# EAGLE design iBookG3Clamshell_T4p0 (EAGLE 9.6.2)
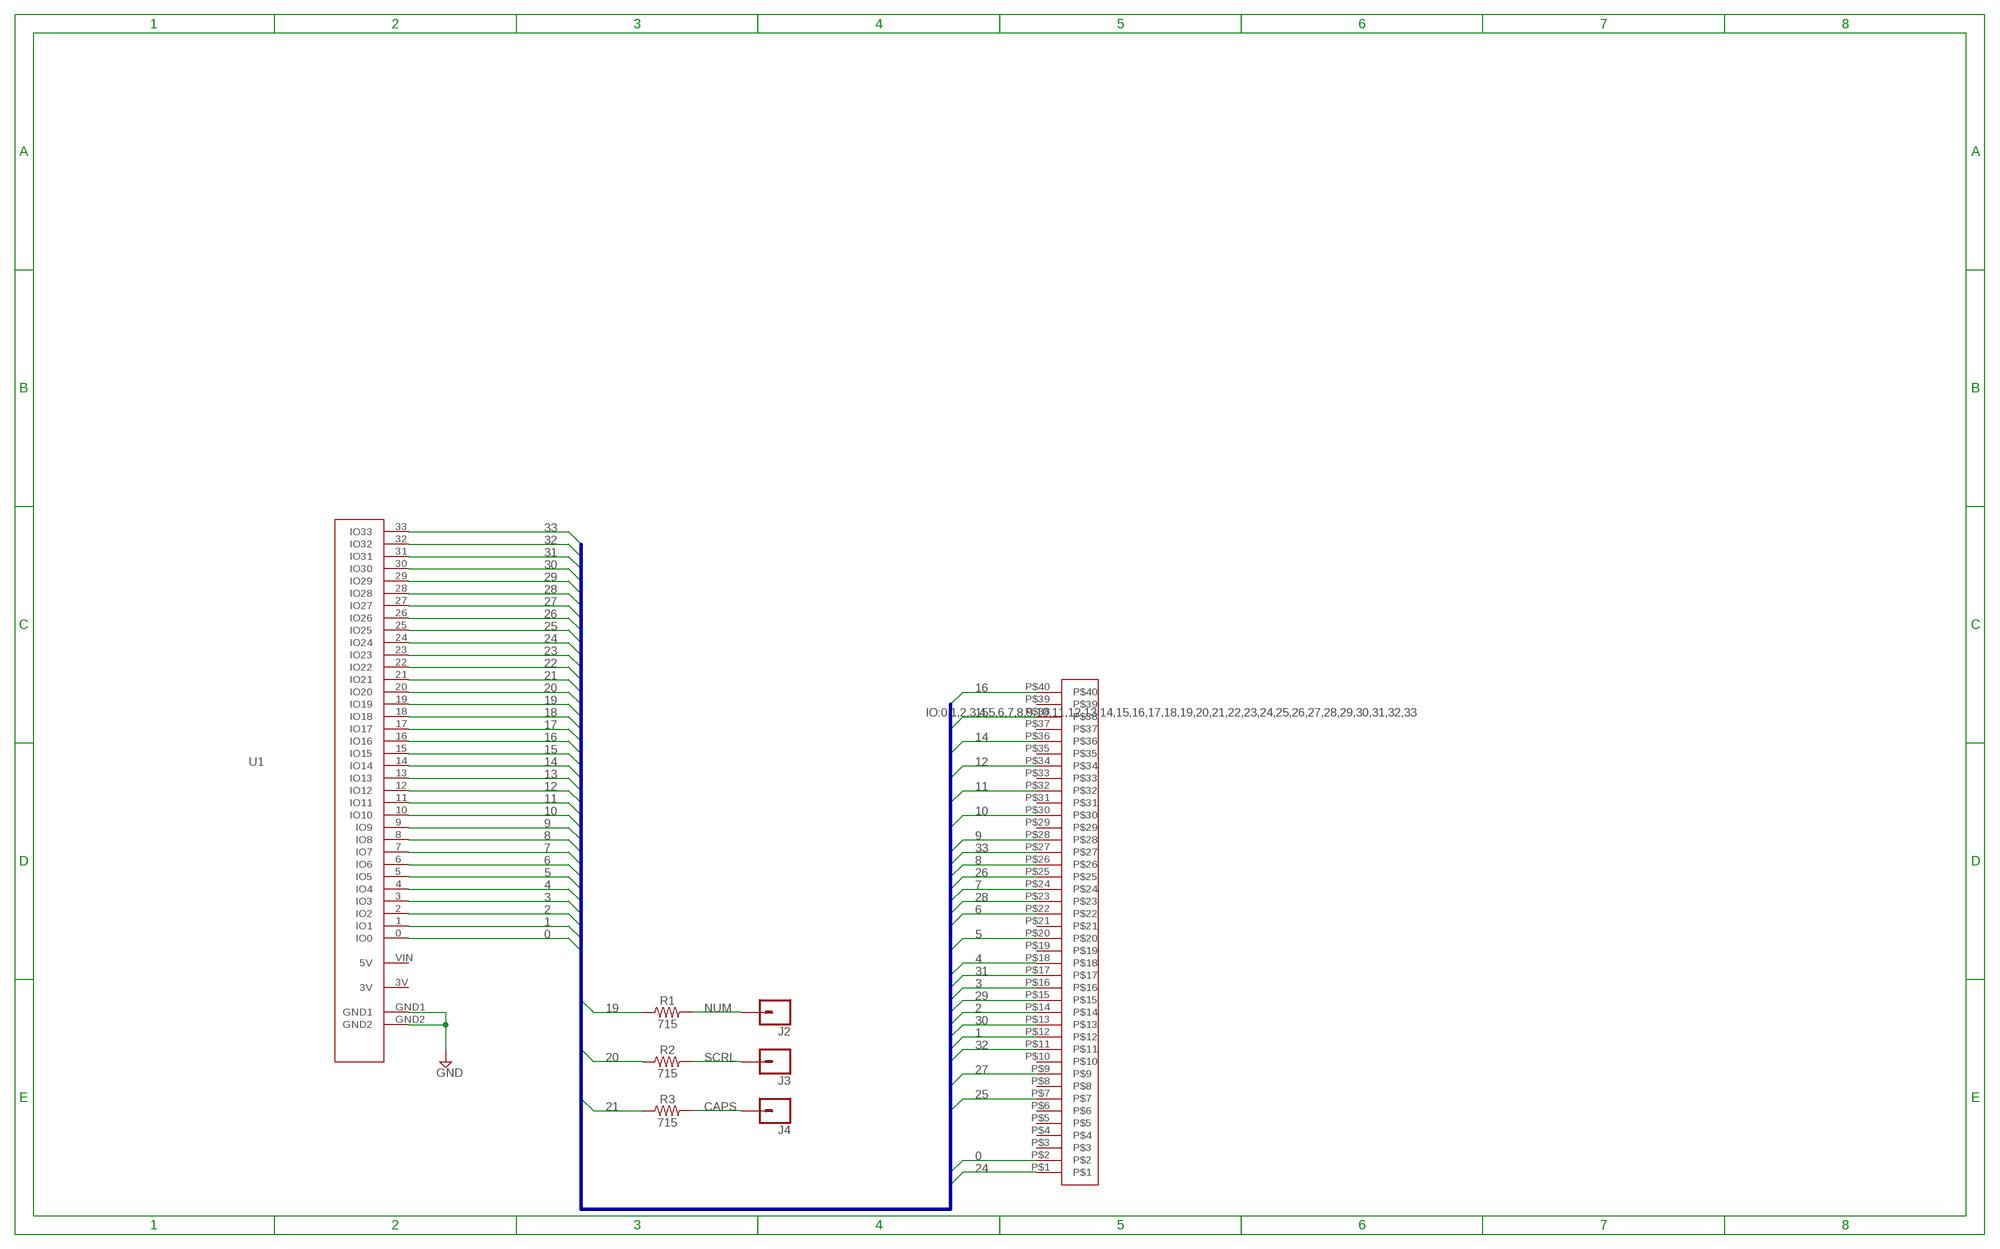
[diagram p0: schematic, sheet 1]

## Parts
J1  HDR127MET40FGVSMDR  [HDR127MET40FGVSMDR]
J2  CONN_01PTH_NO_SILK_YES_STOP  [1X01_NO_SILK]
J3  CONN_01PTH_NO_SILK_YES_STOP  [1X01_NO_SILK]
J4  CONN_01PTH_NO_SILK_YES_STOP  [1X01_NO_SILK]
R1  715  715OHM-0603-1/10W-1%  [0603]
R2  715  715OHM-0603-1/10W-1%  [0603]
R3  715  715OHM-0603-1/10W-1%  [0603]
U1  TEENSY4P0_CUTOUT  [TEENSY4P0_CUTOUT]

## Nets
0: J1.P$2 U1.0(IO0)
1: J1.P$12 U1.1(IO1)
2: J1.P$14 U1.2(IO2)
3: J1.P$16 U1.3(IO3)
4: J1.P$18 U1.4(IO4)
5: J1.P$20 U1.5(IO5)
6: J1.P$22 U1.6(IO6)
7: J1.P$24 U1.7(IO7)
8: J1.P$26 U1.8(IO8)
9: J1.P$28 U1.9(IO9)
10: J1.P$30 U1.10(IO10)
11: J1.P$32 U1.11(IO11)
12: J1.P$34 U1.12(IO12)
13: U1.13(IO13)
14: J1.P$36 U1.14(IO14)
15: J1.P$38 U1.15(IO15)
16: J1.P$40 U1.16(IO16)
17: U1.17(IO17)
18: U1.18(IO18)
19: R1.1 U1.19(IO19)
20: R2.1 U1.20(IO20)
21: R3.1 U1.21(IO21)
22: U1.22(IO22)
23: U1.23(IO23)
24: J1.P$1 U1.24(IO24)
25: J1.P$7 U1.25(IO25)
26: J1.P$25 U1.26(IO26)
27: J1.P$9 U1.27(IO27)
28: J1.P$23 U1.28(IO28)
29: J1.P$15 U1.29(IO29)
30: J1.P$13 U1.30(IO30)
31: J1.P$17 U1.31(IO31)
32: J1.P$11 U1.32(IO32)
33: J1.P$27 U1.33(IO33)
CAPS: J4.1 R3.2
GND: U1.GND1 U1.GND2
NUM: J2.1 R1.2
SCRL: J3.1 R2.2
Unconnected: J1.P$3 J1.P$4 J1.P$5 J1.P$6 J1.P$8 J1.P$10 J1.P$19 J1.P$21 J1.P$29 J1.P$31 J1.P$33 J1.P$35 J1.P$37 J1.P$39 U1.3V U1.VIN(5V)

## Buses
IO:0,1,2,3,4,5,6,7,8,9,10,11,12,13,14,15,16,17,18,19,20,21,22,23,24,25,26,27,28,29,30,31,32,33

## Library data of the parts
J1 = HDR127MET40FGVSMDR:HDR127MET40FGVSMDR
J2-J4 = SparkFun-Connectors:CONN_01: Single connection point. Often used as Generic Header-pin footprint for 0.1 inch spaced/style header connections On any of the 0.1 inch spaced packages, you can populate with these: Break Away Headers - Straight <https://www.sparkfun.com/products/116> (PRT-00116) Break Away Male Headers - Right Angle <https://www.sparkfun.com/products/553> (PRT-00553) Female Headers <https://www.sparkfun.com/products/115> (PRT-00115) Break Away Headers - Machine Pin <https://www.sparkfun.com/products/117> (PRT-00117) Break Away Female Headers - Swiss Machine Pin <https://www.sparkfun.com/products/743> (PRT-00743) This device is also useful as a general connection point to wire up your design to another part of your project. Our various solder wires solder well into these plated through hole pads. Hook-Up Wire - Assortment (Stranded, 22 AWG) <https://www.sparkfun.com/products/11375> (PRT-11375) Hook-Up Wire - Assortment (Solid Core, 22 AWG) <https://www.sparkfun.com/products/11367> (PRT-11367) View the entire wire category on our website here <https://www.sparkfun.com/categories/141> Special notes: SMTSO-256-ET is a "flush mount" nut for a 4-40 screw. We mostly use this on specialty testbeds; it is a nice way to connect hardware to your PCB at an adjustable hieght. Also note, the SNAP packages are for using a snappable style connector. We sell a baggie of snaps and they are also used on two LilyPad designs: Snap Assortment - 30 pack (male and female) <https://www.sparkfun.com/products/11347> (DEV-11347) LilyPad Arduino SimpleSnap <https://www.sparkfun.com/products/10941> (DEV-10941) LilyPad SimpleSnap Protoboard <https://www.sparkfun.com/products/10940> (DEV-10940)
R1-R3 = SparkFun-Resistors:715OHM: 715Ω resistor A resistor is a passive two-terminal electrical component that implements electrical resistance as a circuit element. Resistors act to reduce current flow, and, at the same time, act to lower voltage levels within circuits. - Wikipedia; PROD_ID: RES-07850
U1 = TEENSY4P0_CUTOUT:TEENSY4P0_CUTOUT

## Board
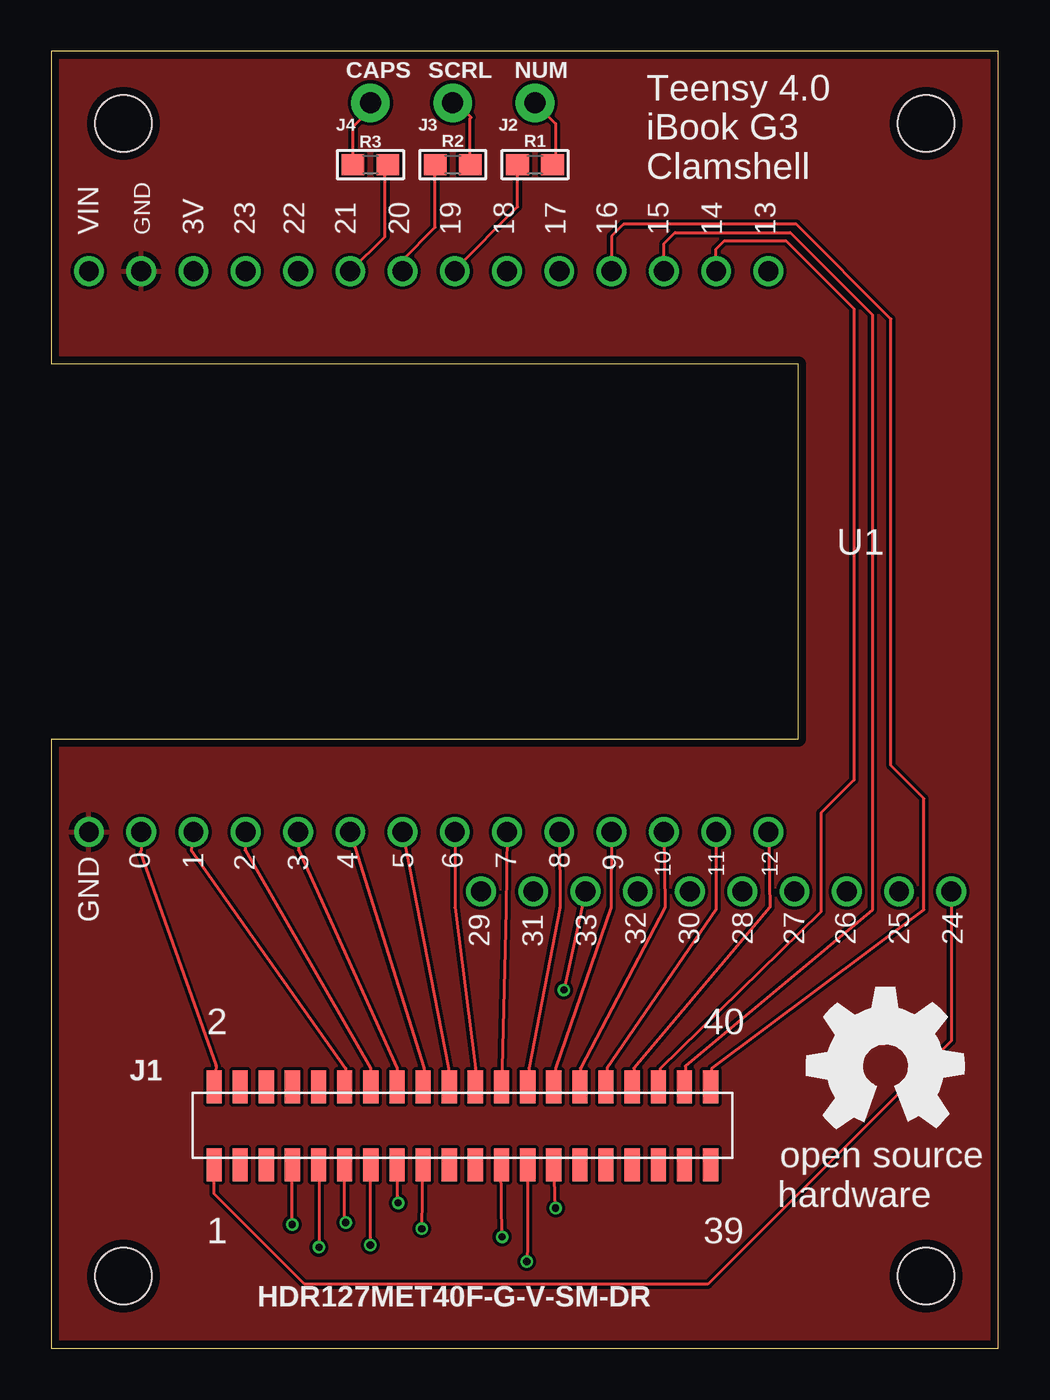
[diagram p1: board, top side]
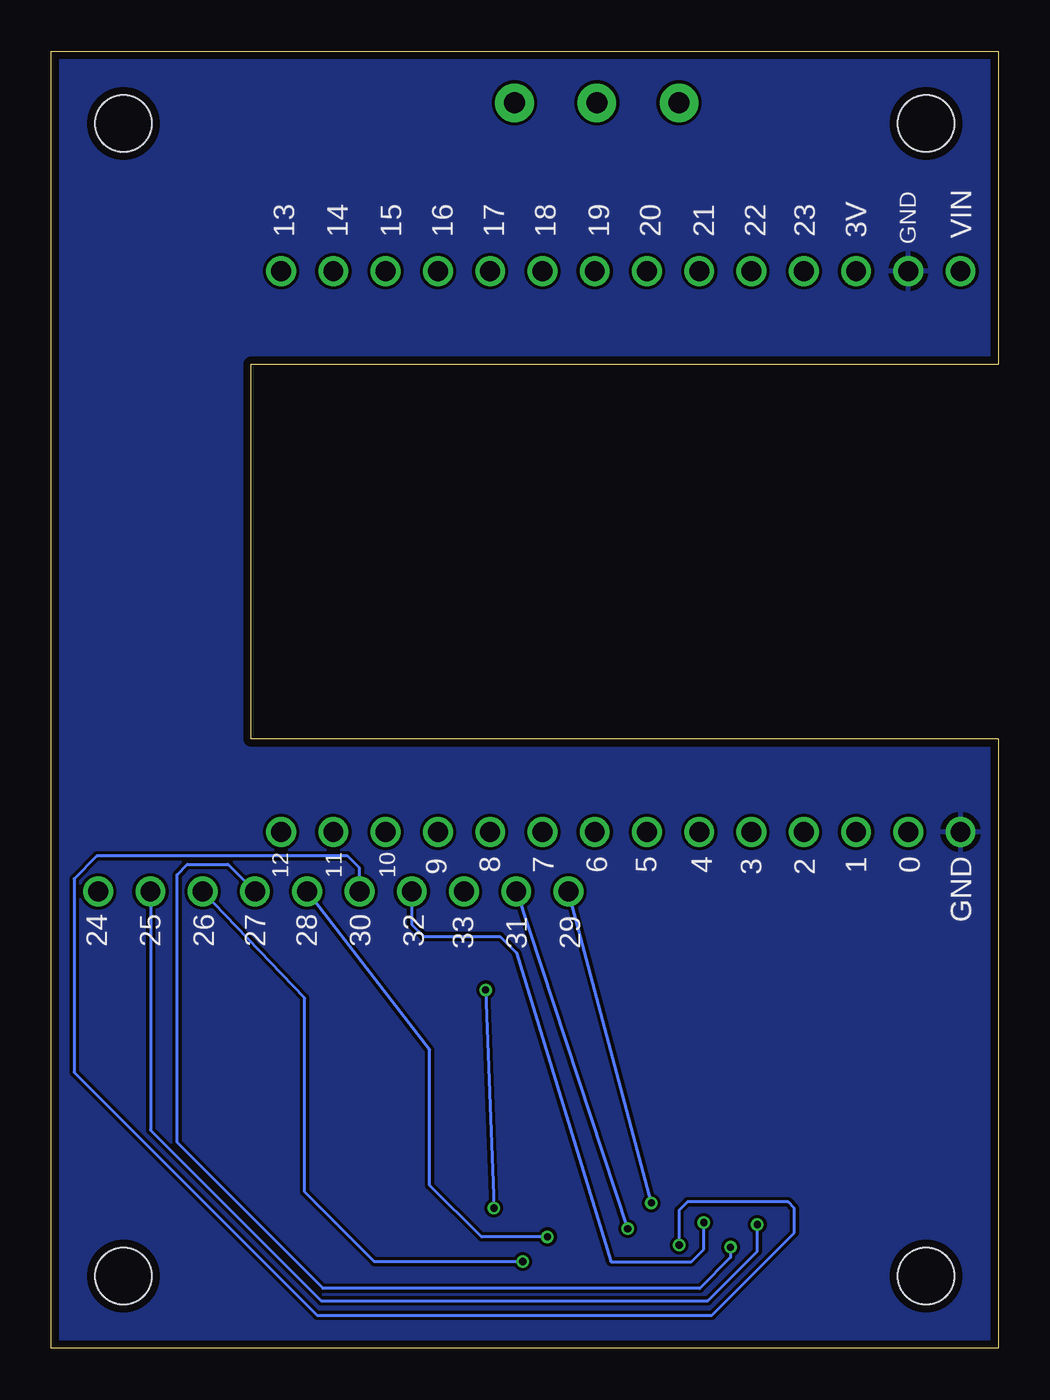
[diagram p2: board, bottom side, seen from below]

Size 46 x 63 mm. Coordinates in mm from the lower left corner, seen from the top.
Outline: 0,0 46,0 46,63 0,63 0,47.8 36.3,47.8 36.3,29.6 0,29.6 0,0
Copper layers (1*16): Top 0.035559375mm / dielectric 1.6mm / Bottom 0.035559375mm
Design rules "oshpark-2layer": minimum track width 6mil, minimum drill 10mil, track to track 6mil, track to pad 6mil, pad to pad 6mil, via to via 6mil, smd to smd 6mil, copper to edge 15mil, drill to drill 6mil, minimum pad ring 5mil, minimum via ring 5mil, stop-mask expansion 2.5mil, vias tented up to drill 0mil, thermal gap 10mil
Holes 2.75 mm at 3.5,59.5 3.5,3.5 42.5,3.5 42.5,59.5

### Footprints (pad centres in the part's own frame; a part is rotated, then mirrored left to right if it is on the bottom)
HDR127MET40FGVSMDR = smd 0.74 x 1.6: P$1 0,-0.8; P$2 0,3; P$3 1.27,-0.8; P$4 1.27,3; P$5 2.54,-0.8; P$6 2.54,3; P$7 3.81,-0.8; P$8 3.81,3; P$9 5.08,-0.8; P$10 5.08,3; P$11 6.35,-0.8; P$12 6.35,3; P$13 7.62,-0.8; P$14 7.62,3; P$15 8.89,-0.8; P$16 8.89,3; P$17 10.16,-0.8; P$18 10.16,3; P$19 11.43,-0.8; P$20 11.43,3; P$21 12.7,-0.8; P$22 12.7,3; P$23 13.97,-0.8; P$24 13.97,3; P$25 15.24,-0.8; P$26 15.24,3; P$27 16.51,-0.8; P$28 16.51,3; P$29 17.78,-0.8; P$30 17.78,3; P$31 19.05,-0.8; P$32 19.05,3; P$33 20.32,-0.8; P$34 20.32,3; P$35 21.59,-0.8; P$36 21.59,3; P$37 22.86,-0.8; P$38 22.86,3; P$39 24.13,-0.8; P$40 24.13,3
1X01_NO_SILK = drill 1.016 pad 1.88: 1 0,0
0603 = smd 1.1 x 1: 1 -0.85,0; 2 0.85,0
TEENSY4P0_CUTOUT = drill 0.965: 0 -15.24,-13.62; 1 -12.7,-13.62; 2 -10.16,-13.62; 3 -7.62,-13.62; 3V -12.7,13.62; 4 -5.08,-13.62; 5 -2.54,-13.62; 6 0,-13.62; 7 2.54,-13.62; 8 5.08,-13.62; 9 7.62,-13.62; 10 10.16,-13.62; 11 12.7,-13.62; 12 15.24,-13.62; 13 15.24,13.62; 14 12.7,13.62; 15 10.16,13.62; 16 7.62,13.62; 17 5.08,13.62; 18 2.54,13.62; 19 0,13.62; 20 -2.54,13.62; 21 -5.08,13.62; 22 -7.62,13.62; 23 -10.16,13.62; 24 24.13,-16.51; 25 21.59,-16.51; 26 19.05,-16.51; 27 16.51,-16.51; 28 13.97,-16.51; 29 1.27,-16.51; 30 11.43,-16.51; 31 3.81,-16.51; 32 8.89,-16.51; 33 6.35,-16.51; GND1 -17.78,-13.62; GND2 -15.24,13.62; VIN -17.78,13.62

### Placement (x,y rotation side)
J1  7.9,9.7 0 top
J2  23.5,60.5 0 top
J3  19.5,60.5 0 top
J4  15.5,60.5 0 top
R1  23.5,57.5 0 top
R2  19.5,57.5 0 top
R3  15.5,57.5 180 top
U1  19.6,38.7 0 top
U$1  [OSHW_8MM]  40.5,13.7 0 top

### Tracks (layer width: path | path; a pad name or v marks a point on that pad's centre or on a via)
0
  Top 0.152: U1.0 4.36,24.16 4.3,24.1 8,13.7 J1.P$2
1
  Top 0.152: U1.1 6.8,24.2 14.3,13.6 J1.P$12
2
  Top 0.152: U1.2 9.4,24.2 15.5,13.6 J1.P$14
3
  Top 0.152: U1.3 12,24.2 16.8,13.6 J1.P$16
4
  Top 0.152: U1.4 18.1,13.6 J1.P$18
5
  Top 0.152: U1.5 19.3,13.6 J1.P$20
6
  Top 0.152: U1.6 19.6,21.4 20.6,13.6 J1.P$22
7
  Top 0.152: U1.7 22.1,21.3 21.9,13.6 J1.P$24
8
  Top 0.152: U1.8 24.7,21.4 23.2,13.6 J1.P$26
9
  Top 0.152: U1.9 27.2,21.4 24.5,13.6 J1.P$28
10
  Top 0.152: U1.10 29.8,21.4 25.7,13.6 J1.P$30
11
  Top 0.152: U1.11 32.3,21.3 27,13.6 J1.P$32
12
  Top 0.152: U1.12 34.9,21.4 28.3,13.6 J1.P$34
14
  Top 0.152: J1.P$36 29.6,13.6 37.4,21.2 37.4,26 39,27.6 39,50.5 35.7,53.8 32.7,53.8 32.3,53.4 U1.14
15
  Top 0.152: U1.15 29.76,53.66 30.3,54.2 35.9,54.2 39.9,50.2 39.9,21.3 30.8,13.7 J1.P$38
16
  Top 0.152: J1.P$40 32.1,13.6 42.4,21.3 42.4,26.7 40.8,28.3 40.8,50 36.2,54.6 27.8,54.6 27.22,54.02 U1.16
19
  Top 0.152: U1.19 19.6,52.4 22.65,55.45 R1.1
20
  Top 0.152: U1.20 17.06,52.86 18.65,54.45 R2.1
21
  Top 0.152: U1.21 16.2,54 16.2,57.35 R3.1
24
  Top 0.152: U1.24 43.73,14.93 31.9,3.1 12.3,3.1 7.9,7.5 J1.P$1
25  (via drill 0.35)
  Top 0.152: v11.7,6 J1.P$7
  Bottom 0.152: U1.25 41.19,10.59 32.9,2.3 14.1,2.3 11.7,4.7 v11.7,6
26  (via drill 0.35)
  Top 0.152: J1.P$25 23.14,5.09 v23.1,4.2
  Bottom 0.152: U1.26 33.7,17 33.7,7.6 30.3,4.2 v23.1,4.2
27  (via drill 0.35)
  Top 0.152: J1.P$9 13,8.88 v13,4.9
  Bottom 0.152: v13,4.9 13,4.4 14.5,2.9 32.8,2.9 39.9,10 39.9,23 39.4,23.5 37.42,23.5 U1.27
28  (via drill 0.35)
  Top 0.152: v21.9,5.4 21.84,8.87 J1.P$23
  Bottom 0.152: U1.28 27.61,14.49 27.61,7.91 25.1,5.4 v21.9,5.4
29  (via drill 0.35)
  Top 0.152: J1.P$15 16.79,7.01 16.8,7 v16.85,7.05
  Bottom 0.152: v16.85,7.05 U1.29
30  (via drill 0.35)
  Top 0.152: v15.5,5 15.5,8.88 J1.P$13
  Bottom 0.152: U1.30 31.03,23.33 31.6,23.9 43.8,23.9 44.9,22.8 44.9,13.4 33.1,1.6 13.9,1.6 9.9,5.6 9.9,6.8 10.2,7.1 15.1,7.1 15.5,6.7 v15.5,5
31  (via drill 0.35)
  Top 0.152: v18,5.8 J1.P$17
  Bottom 0.152: U1.31 v18,5.8
32  (via drill 0.35)
  Top 0.152: v14.3,6.1 14.25,6.15 J1.P$11
  Bottom 0.152: U1.32 28.49,20.59 27.9,20 24.2,20 23.4,19.2 18.82,4.2 14.9,4.2 14.3,4.8 v14.3,6.1
33  (via drill 0.35)
  Top 0.152: U1.33 v24.9,17.4 | v24.5,6.8 J1.P$27
  Bottom 0.152: v24.9,17.4 v24.5,6.8
CAPS
  Top 0.152: R3.2 14.65,59.35 15.5,60.2 J4.1
GND
  pour Top: 0,0 0,29.6 36.3,29.6 36.3,47.8 0,47.8 0,63 46,63 46,0
  pour Bottom: 0,0 0,29.6 36.3,29.6 36.3,47.8 0,47.8 0,63 46,63 46,0
NUM
  Top 0.152: J2.1 24.5,59.5 24.5,57.65 R1.2
SCRL
  Top 0.152: R2.2 20.35,59.75 20.4,59.8 19.7,60.5 J3.1

### Text on the board
tPlace: CAPS | SCRL | NUM | Teensy 4.0 / iBook G3 / Clamshell | VIN | GND | 3V | 23 | 22 | 21 | 20 | 19 | 18 | 17 | 16 | 15 | 14 | 13 | GND | 0 | 1 | 2 | 3 | 4 | 5 | 6 | 7 | 8 | 9 | 10 | 11 | 12 | 32 | 30 | 28 | 27 | 26 | 25 | 24 | 29 | 31 | 33 | J1 | HDR127MET40F-G-V-SM-DR
bPlace: VIN | GND | 3V | 23 | 22 | 21 | 20 | 19 | 18 | 17 | 16 | 15 | 14 | 13 | GND | 0 | 1 | 2 | 3 | 4 | 5 | 6 | 7 | 8 | 9 | 10 | 11 | 12 | 29 | 31 | 33 | 32 | 30 | 28 | 27 | 26 | 25 | 24